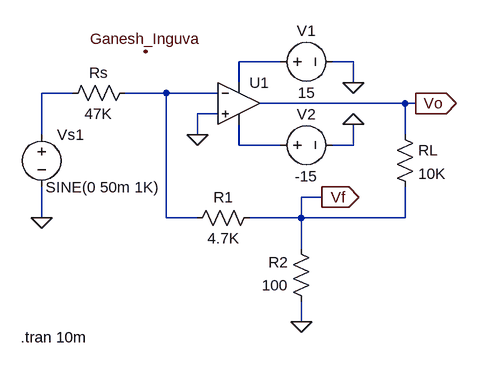
[diagram p0: schematic Run 4_C.asc]
Run 4_C.asc, the LTspice schematic file:
Version 4
SHEET 1 880 680
WIRE 272 0 208 0
WIRE 384 0 352 0
WIRE 208 32 208 0
WIRE 384 32 384 0
WIRE -48 48 -96 48
WIRE 96 48 32 48
WIRE 176 48 96 48
WIRE 464 64 240 64
WIRE 480 64 464 64
WIRE 176 80 144 80
WIRE -96 112 -96 48
WIRE 144 112 144 80
WIRE 464 112 464 64
WIRE 208 128 208 96
WIRE 272 128 208 128
WIRE 384 128 384 96
WIRE 384 128 352 128
WIRE 336 208 304 208
WIRE -96 240 -96 192
WIRE 96 240 96 48
WIRE 144 240 96 240
WIRE 304 240 304 208
WIRE 304 240 224 240
WIRE 464 240 464 192
WIRE 464 240 304 240
WIRE 304 288 304 240
WIRE 304 400 304 368
FLAG 384 32 0
FLAG 384 96 0
FLAG 144 112 0
FLAG 480 64 Vo
IOPIN 480 64 Out
FLAG 304 400 0
FLAG -96 240 0
FLAG 64 -16 Ganesh_Inguva
FLAG 336 208 Vf
IOPIN 336 208 Out
SYMBOL OpAmps\\UniversalOpamp2 208 64 R0
SYMATTR InstName U1
SYMBOL voltage 256 0 R270
WINDOW 0 32 56 VTop 2
WINDOW 3 -32 56 VBottom 2
WINDOW 123 0 0 Left 0
WINDOW 39 0 0 Left 0
SYMATTR InstName V1
SYMATTR Value 15
SYMBOL voltage 256 128 R270
WINDOW 0 32 56 VTop 2
WINDOW 3 -32 56 VBottom 2
WINDOW 123 0 0 Left 0
WINDOW 39 0 0 Left 0
SYMATTR InstName V2
SYMATTR Value -15
SYMBOL res 240 224 R90
WINDOW 0 0 56 VBottom 2
WINDOW 3 32 56 VTop 2
SYMATTR InstName R1
SYMATTR Value 4.7K
SYMBOL res 320 384 R180
WINDOW 0 36 76 Left 2
WINDOW 3 36 40 Left 2
SYMATTR InstName R2
SYMATTR Value 100
SYMBOL res 448 96 R0
SYMATTR InstName RL
SYMATTR Value 10K
SYMBOL voltage -96 96 R0
WINDOW 3 6 97 Left 2
WINDOW 123 0 0 Left 0
WINDOW 39 0 0 Left 0
SYMATTR Value SINE(0 50m 1K)
SYMATTR InstName Vs1
SYMBOL res 48 32 R90
WINDOW 0 0 56 VBottom 2
WINDOW 3 32 56 VTop 2
SYMATTR InstName Rs
SYMATTR Value 47K
TEXT -128 424 Left 2 !.tran 10m

The netlist it stands for:
* Run 4_C.asc
XU1 0 N003 N001 N004 Vo level.2 Avol=1Meg GBW=10Meg Slew=10Meg ilimit=25m rail=0 Vos=0 phimargin=45 en=0 enk=0 in=0 ink=0 Rin=500Meg  ; pins IN+ IN- V+ V- OUT
V1 N001 0 15
V2 N004 0 -15
R1 Vf N003 4.7K
R2 0 Vf 100
RL Vo Vf 10K
Vs1 N002 0 SINE(0 50m 1K)
Rs N003 N002 47K
.tran 10m
.lib UniversalOpamps2.sub
.backanno
.end